# Altium schematic sheet AUDIO_AMP_NB2A.SchDoc: AUDIO SUB-SYSTEM
size A4; Organization: Altium Limited.; Address1: Level 3, 12a Rodborough Rd; Address2: Frenchs Forest 2086; Address3: NSW; Address4: AUSTRALIA; SheetNumber: 1; SheetTotal: 100; PageSetup: Record=PageOptions|CenterHorizontal=True|CenterVertical=True|PrintScale=0.97|XCorrection=1.00|YCorrection=1.00|PrintKind=0|BorderSize=5000000|LeftOffset=0|BottomOffset=0|Orientation=2|PaperLength=1000|PaperWidth=1000|Scale=100|PaperSource=7|PrintQuality=-4|MediaType=1|DitherType=10|PaperKind=A4 (210 x 297 mm)|PrintScaleMode=1
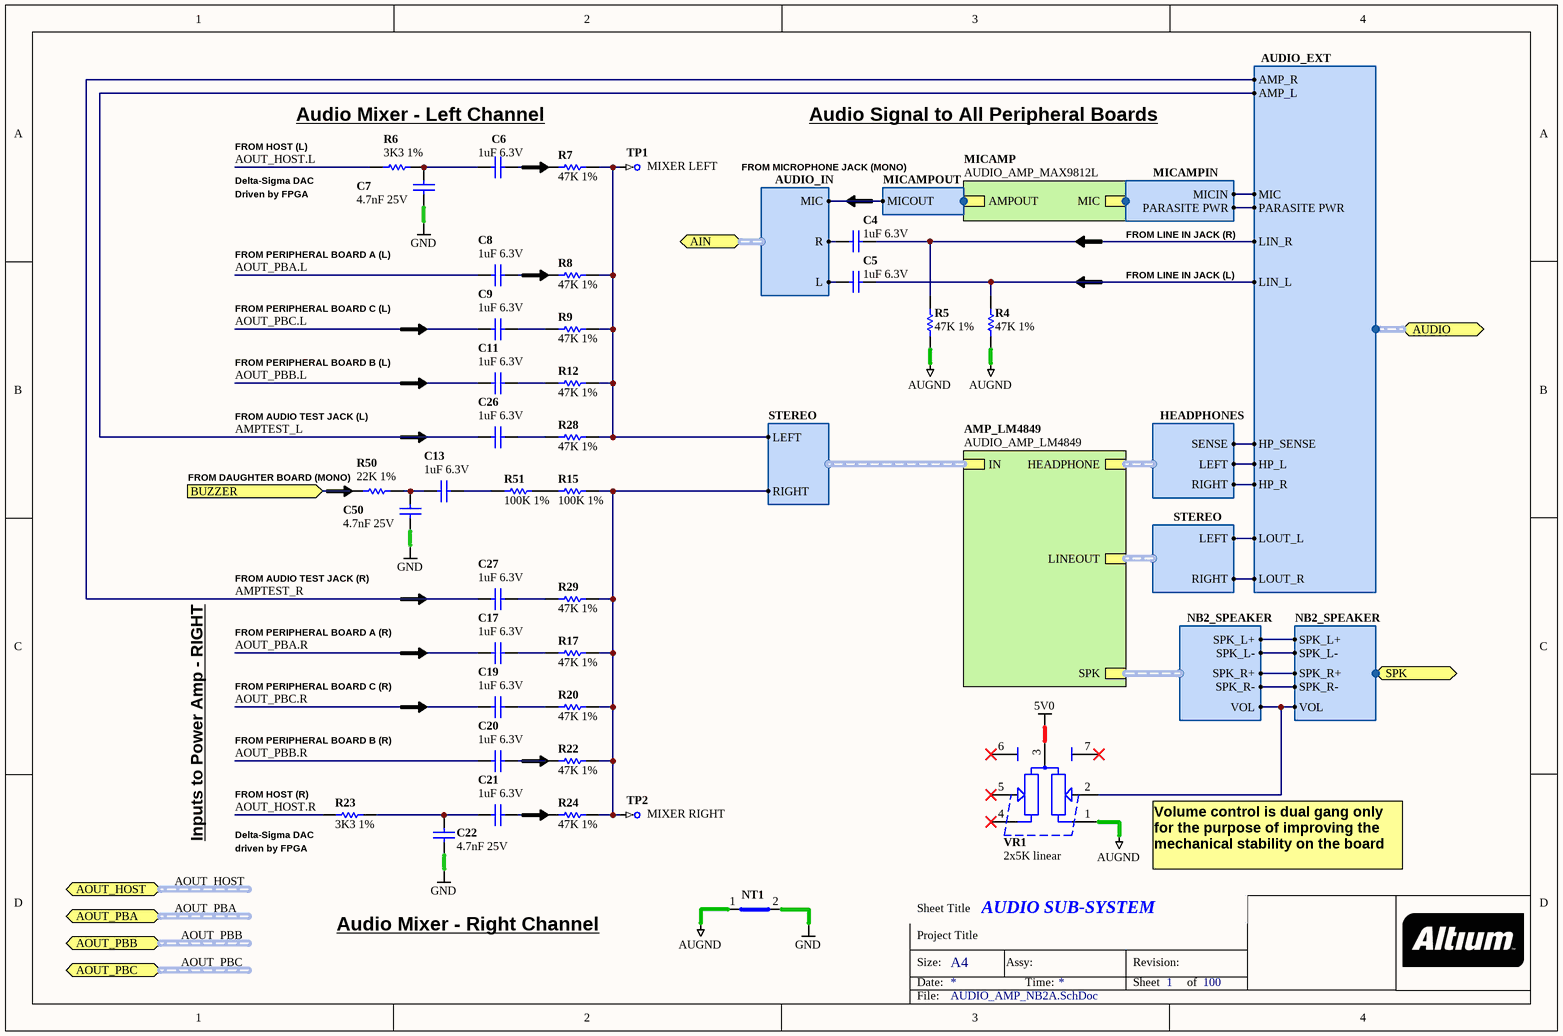
[diagram p0: AUDIO_AMP_NB2A.SchDoc]

## Parts
C4  1uF 6.3V  [CAPC1005-STAR]
C5  1uF 6.3V  [CAPC1005-STAR]
C6  1uF 6.3V  [CAPC1005-STAR]
C7  4.7nF 25V  [CAPC1005-STAR]
C8  1uF 6.3V  [CAPC1005-STAR]
C9  1uF 6.3V  [CAPC1005-STAR]
C11  1uF 6.3V  [CAPC1005-STAR]
C13  1uF 6.3V  [CAPC1005-STAR]
C17  1uF 6.3V  [CAPC1005-STAR]
C19  1uF 6.3V  [CAPC1005-STAR]
C20  1uF 6.3V  [CAPC1005-STAR]
C21  1uF 6.3V  [CAPC1005-STAR]
C22  4.7nF 25V  [CAPC1005-STAR]
C26  1uF 6.3V  [CAPC1005-STAR]
C27  1uF 6.3V  [CAPC1005-STAR]
C50  4.7nF 25V  [CAPC1005-STAR]
NT1  Net Tie SMT2  [NETTIE-SMT2-31X39]  (value not drawn)  (net tie, no BOM)
R4  47K 1%  [RESC1005-STAR]
R5  47K 1%  [RESC1005-STAR]
R6  3K3 1%  [RESC1005-STAR]
R7  47K 1%  [RESC1005-STAR]
R8  47K 1%  [RESC1005-STAR]
R9  47K 1%  [RESC1005-STAR]
R12  47K 1%  [RESC1005-STAR]
R15  100K 1%  [RESC1005-STAR]
R17  47K 1%  [RESC1005-STAR]
R20  47K 1%  [RESC1005-STAR]
R22  47K 1%  [RESC1005-STAR]
R23  3K3 1%  [RESC1005-STAR]
R24  47K 1%  [RESC1005-STAR]
R28  47K 1%  [RESC1005-STAR]
R29  47K 1%  [RESC1005-STAR]
R50  22K 1%  [RESC1005-STAR]
R51  100K 1%  [RESC1005-STAR]
TP1  MIXER LEFT  [TestPin]  (no BOM)
TP2  MIXER RIGHT  [TestPin]  (no BOM)
VR1  2x5K linear  [POT-R0911G-A1]

## Sub-sheets
AMP_LM4849 = AUDIO_AMP_LM4849: SPK (harness NB2_SPEAKER), IN (harness STEREO), LINEOUT (harness STEREO), HEADPHONE (harness HEADPHONES)
MICAMP = AUDIO_AMP_MAX9812L: MIC (harness MICAMPIN), AMPOUT (harness MICAMPOUT)

## Ports
AIN (harness AUDIO_IN), AOUT_HOST (harness AUDIO_OUT), AOUT_PBA (harness AUDIO_OUT), AOUT_PBB (harness AUDIO_OUT), AOUT_PBC (harness AUDIO_OUT), AUDIO (harness AUDIO_EXT), BUZZER (in), SPK (harness NB2_SPEAKER)

## Harnesses
AUDIO_IN: L, R, MIC
AUDIO_EXT: AMP_L, AMP_R, HP_L, HP_R, HP_SENSE, LIN_L, LIN_R, LOUT_L, LOUT_R, MIC, PARASITE PWR
MICAMPIN: MICIN, PARASITE PWR
MICAMPOUT: MICOUT
STEREO: RIGHT, LEFT
HEADPHONES: RIGHT, LEFT, SENSE
NB2_SPEAKER: SPK_L-, SPK_L+, SPK_R-, SPK_R+, VOL

## Nets
5V0: VR1.3
AUGND: NT1.1(Net1) R4.1 R5.1 VR1.1
GND: C7.2 C22.2 C50.2 NT1.2(Net2)
AMPTEST_L: C26.2 ; port AUDIO.AMP_L
AMPTEST_R: C27.2 ; port AUDIO.AMP_R
AOUT_HOST.L: R6.1
AOUT_HOST.R: R23.1
AOUT_PBA.L: C8.2
AOUT_PBA.R: C17.2
AOUT_PBB.L: C11.2
AOUT_PBB.R: C20.2
AOUT_PBC.L: C9.2
AOUT_PBC.R: C19.2
BUZZER: R50.1 ; port BUZZER
NetC4_1: C4.1 R5.2 ; port AUDIO.LIN_R
NetC4_2: C4.2 ; port AIN.R
NetC5_1: C5.1 R4.2 ; port AUDIO.LIN_L
NetC5_2: C5.2 ; port AIN.L
NetC6_1: C6.1 R7.1
NetC6_2: C6.2 C7.1 R6.2
NetC8_1: C8.1 R8.1
NetC9_1: C9.1 R9.1
NetC11_1: C11.1 R12.1
NetC13_1: C13.1 R51.1
NetC13_2: C13.2 C50.1 R50.2
NetC17_1: C17.1 R17.1
NetC19_1: C19.1 R20.1
NetC20_1: C20.1 R22.1
NetC21_1: C21.1 R24.1
NetC21_2: C21.2 C22.1 R23.2
NetC26_1: C26.1 R28.1
NetC27_1: C27.1 R29.1
NetR7_2: R7.2 R8.2 R9.2 R12.2 R28.2 TP1.1 ; sheet AMP_LM4849/IN.LEFT
NetR15_1: R15.1 R51.2
NetR15_2: R15.2 R17.2 R20.2 R22.2 R24.2 R29.2 TP2.1 ; sheet AMP_LM4849/IN.RIGHT
NetVR1_2: VR1.2 ; port SPK.VOL, sheet AMP_LM4849/SPK.VOL
(unnamed): port AIN.MIC, sheet MICAMP/AMPOUT.MICOUT
(unnamed): port AUDIO.HP_L, sheet AMP_LM4849/HEADPHONE.LEFT
(unnamed): port AUDIO.HP_R, sheet AMP_LM4849/HEADPHONE.RIGHT
(unnamed): port AUDIO.HP_SENSE, sheet AMP_LM4849/HEADPHONE.SENSE
(unnamed): port AUDIO.LOUT_L, sheet AMP_LM4849/LINEOUT.LEFT
(unnamed): port AUDIO.LOUT_R, sheet AMP_LM4849/LINEOUT.RIGHT
(unnamed): port AUDIO.MIC, sheet MICAMP/MIC.MICIN
(unnamed): port AUDIO.PARASITE PWR, sheet MICAMP/MIC.PARASITE PWR
(unnamed): port SPK.SPK_L-, sheet AMP_LM4849/SPK.SPK_L-
(unnamed): port SPK.SPK_L+, sheet AMP_LM4849/SPK.SPK_L+
(unnamed): port SPK.SPK_R-, sheet AMP_LM4849/SPK.SPK_R-
(unnamed): port SPK.SPK_R+, sheet AMP_LM4849/SPK.SPK_R+

Not connected (* = marked no-connect by the designer): VR1 4* 5* 6* 7*

## Buses and harness runs
harness AOUT_HOST = port AOUT_HOST
harness AOUT_PBA = port AOUT_PBA
harness AOUT_PBB = port AOUT_PBB
harness AOUT_PBC = port AOUT_PBC

## Notes on the sheet
- FROM HOST (L)
- Audio Mixer - Left Channel
- FROM MICROPHONE JACK (MONO)
- Audio Signal to All Peripheral Boards
- Delta-Sigma DAC
- Driven by FPGA
- FROM LINE IN JACK (R)
- FROM PERIPHERAL BOARD A (L)
- FROM PERIPHERAL BOARD C (L)
- FROM LINE IN JACK (L)
- FROM PERIPHERAL BOARD B (L)
- FROM AUDIO TEST JACK (L)
- (near R50) FROM DAUGHTER BOARD (MONO)
- FROM AUDIO TEST JACK (R)
- FROM PERIPHERAL BOARD A (R)
- FROM PERIPHERAL BOARD C (R)
- FROM PERIPHERAL BOARD B (R)
- Inputs to Power Amp - RIGHT
- (near R23) Delta-Sigma DAC
- (near R23) driven by FPGA
- (near R23) FROM HOST (R)
- Volume control is dual gang only for the purpose of improving the mechanical stability on the board
- Audio Mixer - Right Channel
- Sheet Title
- Project Title
- Size:
- Date:
- A4
- Assy:
- Time:
- Revision:
- Sheet
- of
- File:

## Library data of the parts
C4-C6 C8 C9 C11 C13 C17 C19-C21 C26 C27 = D-101-0082: Capacitor, Ceramic, 1uF 10% 6.3V 0402 (1005) X5R; Polarity: Non-Polarized; Category: Capacitor; Capacitance: 1 uF; Dielectric: X5R; Mounting Technology: Surface Mount; Rated Voltage: 6.3 V; Status: Unreleased; Technology: None; Tolerance: 10 %
C7 C22 C50 = D-101-0070: Capacitor, Ceramic, 4.7nF 10% 25V 0402 (1005) X7R; Polarity: Non-Polarized; Category: Capacitor; Capacitance: 4.7 nF; Dielectric: X7R; Mounting Technology: Surface Mount; Rated Voltage: 25 V; Status: Production; Technology: Ceramic; Tolerance: 10 %
NT1 = D-002-0004: Net-Tie, Surface Mount, 2 x 2.0mm x 0.8mm SMT Pads - For 0.8mm Track; Category: Net-Tie; Status: Production
R4 R5 R7-R9 R12 R17 R20 R22 R24 R28 R29 = D-100-0092: Resistor, 47K 1% 0402 (1005); Power Rating: 63 mW; Category: Resistor; Mounting Technology: Surface Mount; Resistance: 47 K; Status: Production; Tolerance: 1 %
R6 R23 = D-100-0098: Resistor, 3K3 1% 0402 (1005); Power Rating: 63 mW; Resistance: 3.3 K; Category: Resistor; Mounting Technology: Surface Mount; Status: Production; Tolerance: 1 %
R15 R51 = D-100-0132: Resistor, 100K 1% 0402 (1005); Power Rating: 63 mW; Category: Resistor; Mounting Technology: Surface Mount; Resistance: 100 K; Status: Production; Tolerance: 1 %
R50 = D-100-0114: Resistor, 22K 1% 0402 (1005); Power Rating: mW; Category: Resistor; Mounting Technology: Surface Mount; Resistance: 22 K; Status: Production; Tolerance: 1 %
TP1 TP2 = D-006-0000: Test Point, PCB Mount with Silkscreen Box; Category: Test-Point; Status: Production
VR1 = D-105-0001: Potentiometer, 2 x 5K Linear 9mm PCB Mount Fluted Shaft; Category: Potentiometer; Status: Production